# Altium schematic sheet HF_FrontEndOverview.SchDoc: HF Front End
size A4; DrawnBy: Patrik Staudenmayer; DocumentNumber: 9; SheetNumber: 9; SheetTotal: 15
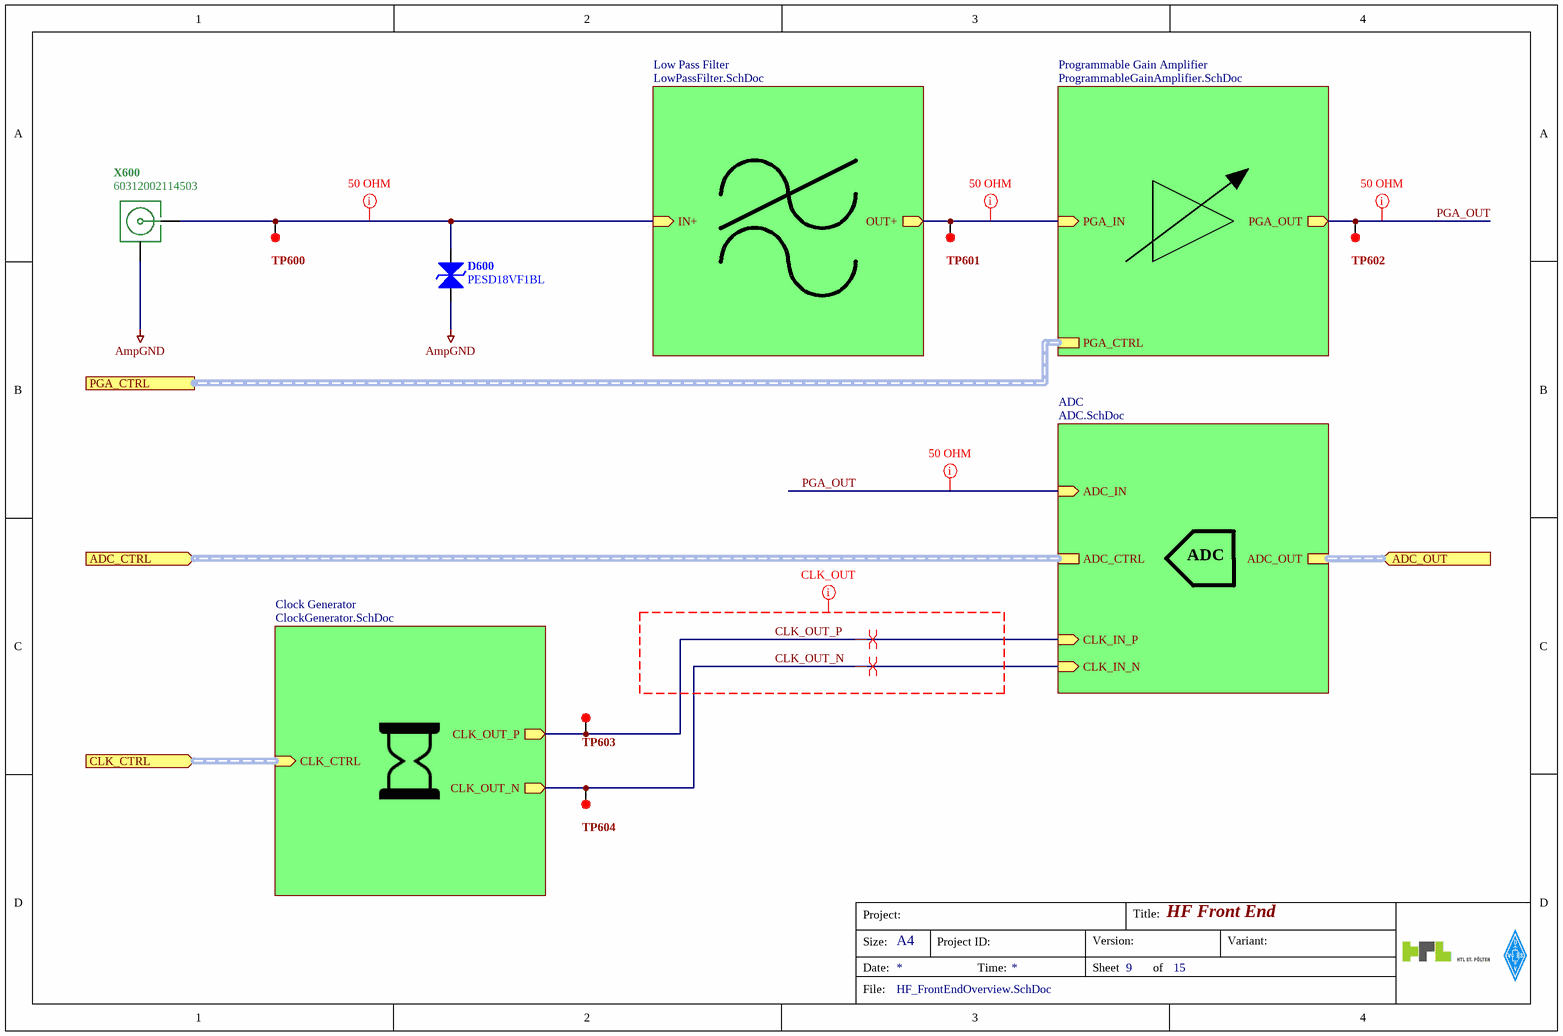
[diagram p0: HF_FrontEndOverview.SchDoc]

## Parts
D600  PESD18VF1BL  [DFN65P98X50-2N IPC]
TP600  TP_GENERIC  [TP_0.8_P100T]  (value not drawn)  (no BOM)
TP601  TP_GENERIC  [TP_0.8_P100T]  (value not drawn)  (no BOM)
TP602  TP_GENERIC  [TP_0.8_P100T]  (value not drawn)  (no BOM)
TP603  TP_GENERIC  [TP_0.8_P100T]  (value not drawn)  (no BOM)
TP604  TP_GENERIC  [TP_0.8_P100T]  (value not drawn)  (no BOM)
X600  60312002114503  [X_60312002114503]

## Sub-sheets
ADC = ADC.SchDoc: ADC_OUT (harness ADC_OUT), CLK_IN_N (in), CLK_IN_P (in), ADC_CTRL (harness ADC_CTRL), ADC_IN (in)
Clock Generator = ClockGenerator.SchDoc: CLK_OUT_P (out), CLK_CTRL (in, harness CLK_CTRL), CLK_OUT_N (out)
Low Pass Filter = LowPassFilter.SchDoc: OUT+ (out), IN+ (in)
Programmable Gain Amplifier = ProgrammableGainAmplifier.SchDoc: PGA_IN (in), PGA_OUT (out), PGA_CTRL (harness PGA_CTRL)

## Ports
ADC_CTRL (in, harness ADC_CTRL), ADC_OUT (in, harness ADC_OUT), CLK_CTRL (in, harness CLK_CTRL), PGA_CTRL (harness PGA_CTRL)

## Nets
AmpGND: D600.2 X600.2(GND)
CLK_OUT_N: TP604.1 ; sheet ADC/CLK_IN_N, sheet Clock Generator/CLK_OUT_N
CLK_OUT_P: TP603.1 ; sheet ADC/CLK_IN_P, sheet Clock Generator/CLK_OUT_P
PGA_OUT: TP602.1 ; sheet Programmable Gain Amplifier/PGA_OUT, sheet ADC/ADC_IN
NetD600_1: D600.1 TP600.1 X600.1(Sig) ; sheet Low Pass Filter/IN+
NetTP601_1: TP601.1 ; sheet Low Pass Filter/OUT+, sheet Programmable Gain Amplifier/PGA_IN

## Buses and harness runs
harness port ADC_CTRL = sheet ADC/ADC_CTRL
harness port ADC_OUT = sheet ADC/ADC_OUT
harness port CLK_CTRL = sheet Clock Generator/CLK_CTRL
harness port PGA_CTRL = sheet Programmable Gain Amplifier/PGA_CTRL

## Layout directives
rule Width Constraint [Pref Impedance = 50.00ohms    Min Impedance = 50.00ohms    Max Impedance = 50.00ohms]; rule Maximum Via Count Constraint [Max Count = 2]: NetD600_1, NetTP601_1, PGA_OUT
differential pair: CLK_OUT_N, CLK_OUT_P
net class CLK_OUT; rule Differential Pairs Routing [Pref Gap = 5mil    Min Gap  = 5mil    Max Gap  = 5milPref Width = 4.138mil    Min Width  = 2.925mil    Max Width  = 4.138mil]; rule Maximum Via Count Constraint [Max Count = 2]; rule Matched Net Lengths [Tolerance = 25mil]: CLK_OUT_N, CLK_OUT_P

## Notes on the sheet
- ADC
- Project:
- Title:
- Size:
- Date:
- A4
- Project ID:
- Time:
- Sheet
- Version:
- of
- Variant:
- File:

## Library data of the parts
D600 = D_TVS_PESD18VF1BL: Ultra low capacitance bidirectional ESD protection diode / Cd = 0.35 pF @ 1 MHz / Reverse standoff voltage Vrwm = 18 V @ 25 °C; Prometheus_Manufacturer: Nexperia; Prometheus_ID: *; Prometheus_ManPartNo: PESD18VF1BL; Prometheus_Comment: PESD18VF1BL; Prometheus_CurrentFootprint: DFN65P98X50-2N IPC; DatasheetURL: https://assets.nexperia.com/documents/data-sheet/PESD18VF1BL.pdf
TP600-TP604 = TP_GENERIC: Needle Test Point; Prometheus_ID: *; Prometheus_ManPartNo: TP_GENERIC; Prometheus_Manufacturer: *; Prometheus_Comment: TP_GENERIC; Prometheus_CurrentFootprint: TP_0.8_P100T
X600 = X_60312002114503: SMA Jack Straight / Type: 348; Prometheus_Manufacturer: Wuerth Electronics; Prometheus_ID: *; Prometheus_ManPartNo: 60312002114503; Prometheus_Comment: 60312002114503; Prometheus_CurrentFootprint: X_60312002114503